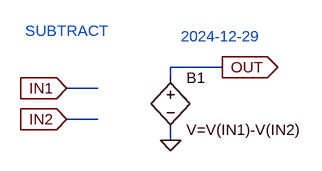
[diagram p0: schematic SUB.asc]
SUB.asc, the LTspice schematic file:
Version 4
SHEET 1 880 680
WIRE 288 96 208 96
WIRE 208 112 208 96
WIRE 96 128 48 128
WIRE 96 176 48 176
WIRE 208 208 208 192
FLAG 48 128 IN1
IOPIN 48 128 In
FLAG 48 176 IN2
IOPIN 48 176 In
FLAG 208 208 0
FLAG 288 96 OUT
IOPIN 288 96 Out
SYMBOL bv 208 96 R0
SYMATTR InstName B1
SYMATTR Value V=V(IN1)-V(IN2)
TEXT -16 40 Left 2 ;SUBTRACT
TEXT 224 48 Left 2 ;2024-12-29

The netlist it stands for:
* SUB.asc
B1 OUT 0 V=V(IN1)-V(IN2)
* SUBTRACT
* 2024-12-29
.backanno
.end